# Altium schematic sheet Sheet1.SchDoc
size A4
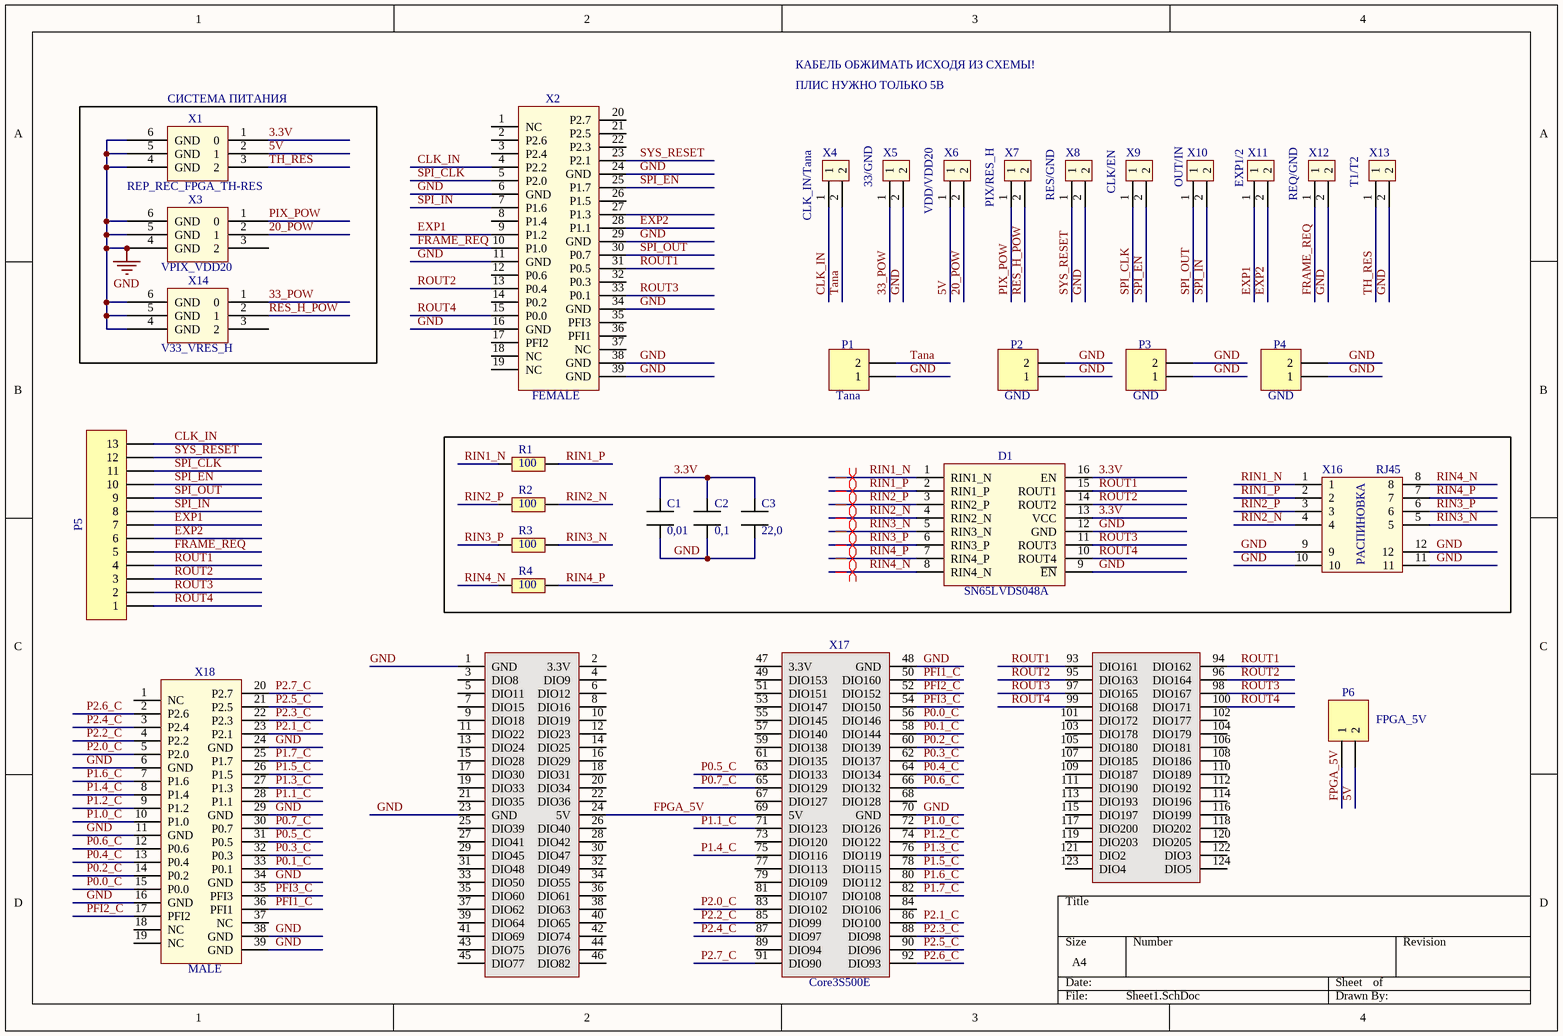
[diagram p0: Sheet1.SchDoc]

## Parts
C1  0,01  [CAP_SMALL]
C2  0,1  [CAP_SMALL]
C3  22,0  [Cap_BIG]
D1  SN65LVDS048A  [SN65LVDS048A (4LVDS)]
P1  Tana  [HDR1X2]
P2  GND  [HDR1X2]
P3  GND  [HDR1X2]
P4  GND  [HDR1X2]
P5  Header 13  [HDR1X13]  (value not drawn)
P6  FPGA_5V  [HDR1X2]
R1  100  [RES]
R2  100  [RES]
R3  100  [RES]
R4  100  [RES]
X1  REP_REC_FPGA_TH-RES  [POWER]
X2  FEMALE  [CHEAP_CONN_FEMALE]
X3  VPIX_VDD20  [POWER]
X4  CLK_IN/Tana  [KLEMMNIK_2]
X5  33/GND  [KLEMMNIK_2]
X6  VDD/VDD20  [KLEMMNIK_2]
X7  PIX/RES_H  [KLEMMNIK_2]
X8  RES/GND  [KLEMMNIK_2]
X9  CLK/EN  [KLEMMNIK_2]
X10  OUT/IN  [KLEMMNIK_2]
X11  EXP1/2  [KLEMMNIK_2]
X12  REQ/GND  [KLEMMNIK_2]
X13  T1/T2  [KLEMMNIK_2]
X14  V33_VRES_H  [POWER]
X16  RJ45  [RJ45]
X17  Core3S500E  [Core3S500E]
X18  MALE  [CHEAP_CONN_MALE]

## Blocks framed on the sheet
СИСТЕМА ПИТАНИЯ: X1 X3 X14

## Nets
GND: C1.1 C2.1 C3.1 D1.9(~{EN}) D1.12(GND) P1.1 P2.1 P2.2 P3.1 P3.2 P4.1 P4.2 X1.4(GND) X1.5(GND) X1.6(GND) X2.6(GND) X2.11(GND) X2.16(GND) X2.24(GND) X2.29(GND) X2.34(GND) X2.38(GND) X2.39(GND) X3.4(GND) X3.5(GND) X3.6(GND) X5.2 X8.2 X12.2 X13.2 X14.4(GND) X14.5(GND) X14.6(GND) X16.9 X16.10 X16.11 X16.12 X17.1(GND) X17.23(GND) X17.48(GND) X17.70(GND) X18.6(GND) X18.11(GND) X18.16(GND) X18.24(GND) X18.29(GND) X18.34(GND) X18.38(GND) X18.39(GND)
3.3V: C1.2 C2.2 C3.2 D1.13(VCC) D1.16(EN) X1.1(0)
5V: P6.2 X1.2(1) X6.1
20_POW: X3.2(1) X6.2
33_POW: X5.1 X14.1(0)
CLK_IN: P5.13 X2.4(P2.2) X4.1
EXP1: P5.7 X2.9(P1.2) X11.1
EXP2: P5.6 X2.28(P1.1) X11.2
FPGA_5V: P6.1 X17.24(5V) X17.69(5V)
FRAME_REQ: P5.5 X2.10(P1.0) X12.1
P0.0_C: X17.56(DIO146) X18.15(P0.0)
P0.1_C: X17.58(DIO144) X18.33(P0.1)
P0.2_C: X17.60(DIO139) X18.14(P0.2)
P0.3_C: X17.62(DIO137) X18.32(P0.3)
P0.4_C: X17.64(DIO134) X18.13(P0.4)
P0.5_C: X17.63(DIO133) X18.31(P0.5)
P0.6_C: X17.66(DIO132) X18.12(P0.6)
P0.7_C: X17.65(DIO129) X18.30(P0.7)
P1.0_C: X17.72(DIO126) X18.10(P1.0)
P1.1_C: X17.71(DIO123) X18.28(P1.1)
P1.2_C: X17.74(DIO122) X18.9(P1.2)
P1.3_C: X17.76(DIO119) X18.27(P1.3)
P1.4_C: X17.75(DIO116) X18.8(P1.4)
P1.5_C: X17.78(DIO115) X18.26(P1.5)
P1.6_C: X17.80(DIO112) X18.7(P1.6)
P1.7_C: X17.82(DIO108) X18.25(P1.7)
P2.0_C: X17.83(DIO102) X18.5(P2.0)
P2.1_C: X17.86(DIO100) X18.23(P2.1)
P2.2_C: X17.85(DIO99) X18.4(P2.2)
P2.3_C: X17.88(DIO98) X18.22(P2.3)
P2.4_C: X17.87(DIO97) X18.3(P2.4)
P2.5_C: X17.90(DIO96) X18.21(P2.5)
P2.6_C: X17.92(DIO93) X18.2(P2.6)
P2.7_C: X17.91(DIO90) X18.20(P2.7)
PFI1_C: X17.50(DIO160) X18.36(PFI1)
PFI2_C: X17.52(DIO152) X18.17(PFI2)
PFI3_C: X17.54(DIO150) X18.35(PFI3)
PIX_POW: X3.1(0) X7.1
RES_H_POW: X7.2 X14.2(1)
RIN1_N: D1.1(RIN1_N) R1.1 X16.1
RIN1_P: D1.2(RIN1_P) R1.2 X16.2
RIN2_N: D1.4(RIN2_N) R2.2 X16.4
RIN2_P: D1.3(RIN2_P) R2.1 X16.3
RIN3_N: D1.5(RIN3_N) R3.2 X16.5
RIN3_P: D1.6(RIN3_P) R3.1 X16.6
RIN4_N: D1.8(RIN4_N) R4.1 X16.8
RIN4_P: D1.7(RIN4_P) R4.2 X16.7
ROUT1: D1.15(ROUT1) P5.4 X2.31(P0.5) X17.93(DIO161) X17.94(DIO162)
ROUT2: D1.14(ROUT2) P5.3 X2.13(P0.4) X17.95(DIO163) X17.96(DIO164)
ROUT3: D1.11(ROUT3) P5.2 X2.33(P0.1) X17.97(DIO165) X17.98(DIO167)
ROUT4: D1.10(ROUT4) P5.1 X2.15(P0.0) X17.99(DIO168) X17.100(DIO171)
SPI_CLK: P5.11 X2.5(P2.0) X9.1
SPI_EN: P5.10 X2.25(P1.7) X9.2
SPI_IN: P5.8 X2.7(P1.6) X10.2
SPI_OUT: P5.9 X2.30(P0.7) X10.1
SYS_RESET: P5.12 X2.23(P2.1) X8.1
Tana: P1.2 X4.2
TH_RES: X1.3(2) X13.1

Not connected (* = marked no-connect by the designer): X2 1(NC) 2(P2.6) 3(P2.4) 8(P1.4) 12(P0.6) 14(P0.2) 17(PFI2) 18(NC) 19(NC) 20(P2.7) 21(P2.5) 22(P2.3) 26(P1.5) 27(P1.3) 32(P0.3) 35(PFI3) 36(PFI1) 37(NC); X3 3(2); X14 3(2); X17 2(3.3V) 3(DIO8) 4(DIO9) 5(DIO11) 6(DIO12) 7(DIO15) 8(DIO16) 9(DIO18) 10(DIO19) 11(DIO22) 12(DIO23) 13(DIO24) 14(DIO25) 15(DIO28) 16(DIO29) 17(DIO30) 18(DIO31) 19(DIO33) 20(DIO34) 21(DIO35) 22(DIO36) 25(DIO39) 26(DIO40) 27(DIO41) 28(DIO42) 29(DIO45) 30(DIO47) 31(DIO48) 32(DIO49) 33(DIO50) 34(DIO55) 35(DIO60) 36(DIO61) 37(DIO62) 38(DIO63) 39(DIO64) 40(DIO65) 41(DIO69) 42(DIO74) 43(DIO75) 44(DIO76) 45(DIO77) 46(DIO82) 47(3.3V) 49(DIO153) 51(DIO151) 53(DIO147) 55(DIO145) 57(DIO140) 59(DIO138) 61(DIO135) 67(DIO127) 68(DIO128) 73(DIO120) 77(DIO113) 79(DIO109) 81(DIO107) 84(DIO106) 89(DIO94) 101(DIO172) 102(DIO177) 103(DIO178) 104(DIO179) 105(DIO180) 106(DIO181) 107(DIO185) 108(DIO186) 109(DIO187) 110(DIO189) 111(DIO190) 112(DIO192) 113(DIO193) 114(DIO196) 115(DIO197) 116(DIO199) 117(DIO200) 118(DIO202) 119(DIO203) 120(DIO205) 121(DIO2) 122(DIO3) 123(DIO4) 124(DIO5); X18 1(NC) 18(NC) 19(NC) 37(NC)

## Layout directives
differential pair: RIN1_N, RIN1_P, RIN2_N, RIN2_P, RIN3_N, RIN3_P, RIN4_N, RIN4_P

## Notes on the sheet
- КАБЕЛЬ ОБЖИМАТЬ ИСХОДЯ ИЗ СХЕМЫ!
- ПЛИС НУЖНО ТОЛЬКО 5В
- (in symbol RJ45) РАСПИНОВКА

## Library data of the parts
C1 C2 = CAP_SMALL
C3 = CAP_BIG
D1 = SN65LVDS048A (4LVDS)
P1-P4 P6 = Header 2: Header, 2-Pin; LatestRevisionDate: 17-Jul-2002; LatestRevisionNote: Re-released for DXP Platform.; Publisher: Altium Limited
P5 = Header 13: Header, 13-Pin; LatestRevisionDate: 17-Jul-2002; LatestRevisionNote: Re-released for DXP Platform.; Publisher: Altium Limited
R1-R4 = RES
X1 X3 X14 = POWER
X2 = CHEAP_CON_37_FEMALE
X4-X13 = KLEMMNIK_2
X18 = CHEAP_CON_37_MALE